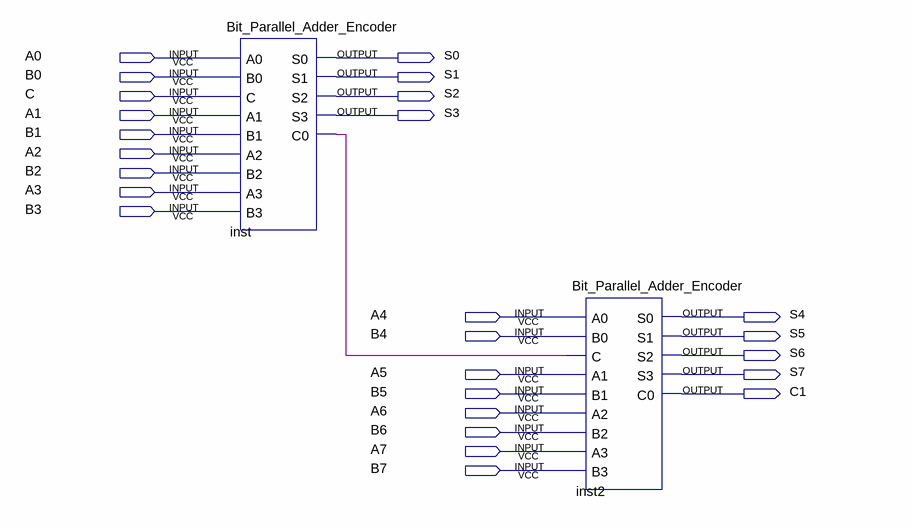
[diagram p0: schematic sheet]
// Quartus schematic Bit_Parallel_Adder_eight_bits.bdf as structural Verilog: 2 symbols, 26 pins
module Bit_Parallel_Adder_eight_bits (
  input  A0,
  input  B0,
  input  C,
  input  A1,
  input  B1,
  input  A2,
  input  B2,
  input  A3,
  input  B3,
  input  A4,
  input  B4,
  input  A5,
  input  B5,
  input  A6,
  input  B6,
  input  A7,
  input  B7,
  output S0,
  output S1,
  output S2,
  output S3,
  output S4,
  output S5,
  output S6,
  output S7,
  output C1
);

  wire inst_c0;

  Bit_Parallel_Adder_Encoder inst (
    .A0(A0), .B0(B0), .C(C), .A1(A1), .B1(B1), .A2(A2), .B2(B2), .A3(A3), .B3(B3), .S0(S0), .S1(S1), .S2(S2),
    .S3(S3), .C0(inst_c0));
  Bit_Parallel_Adder_Encoder inst2 (
    .A0(A4), .B0(B4), .C(inst_c0), .A1(A5), .B1(B5), .A2(A6), .B2(B6), .A3(A7), .B3(B7), .S0(S4), .S1(S5),
    .S2(S6), .S3(S7), .C0(C1));
endmodule
